# EAGLE design BR103_MKL_3357_21MTC_J1_006_01_06 (EAGLE 5.10)
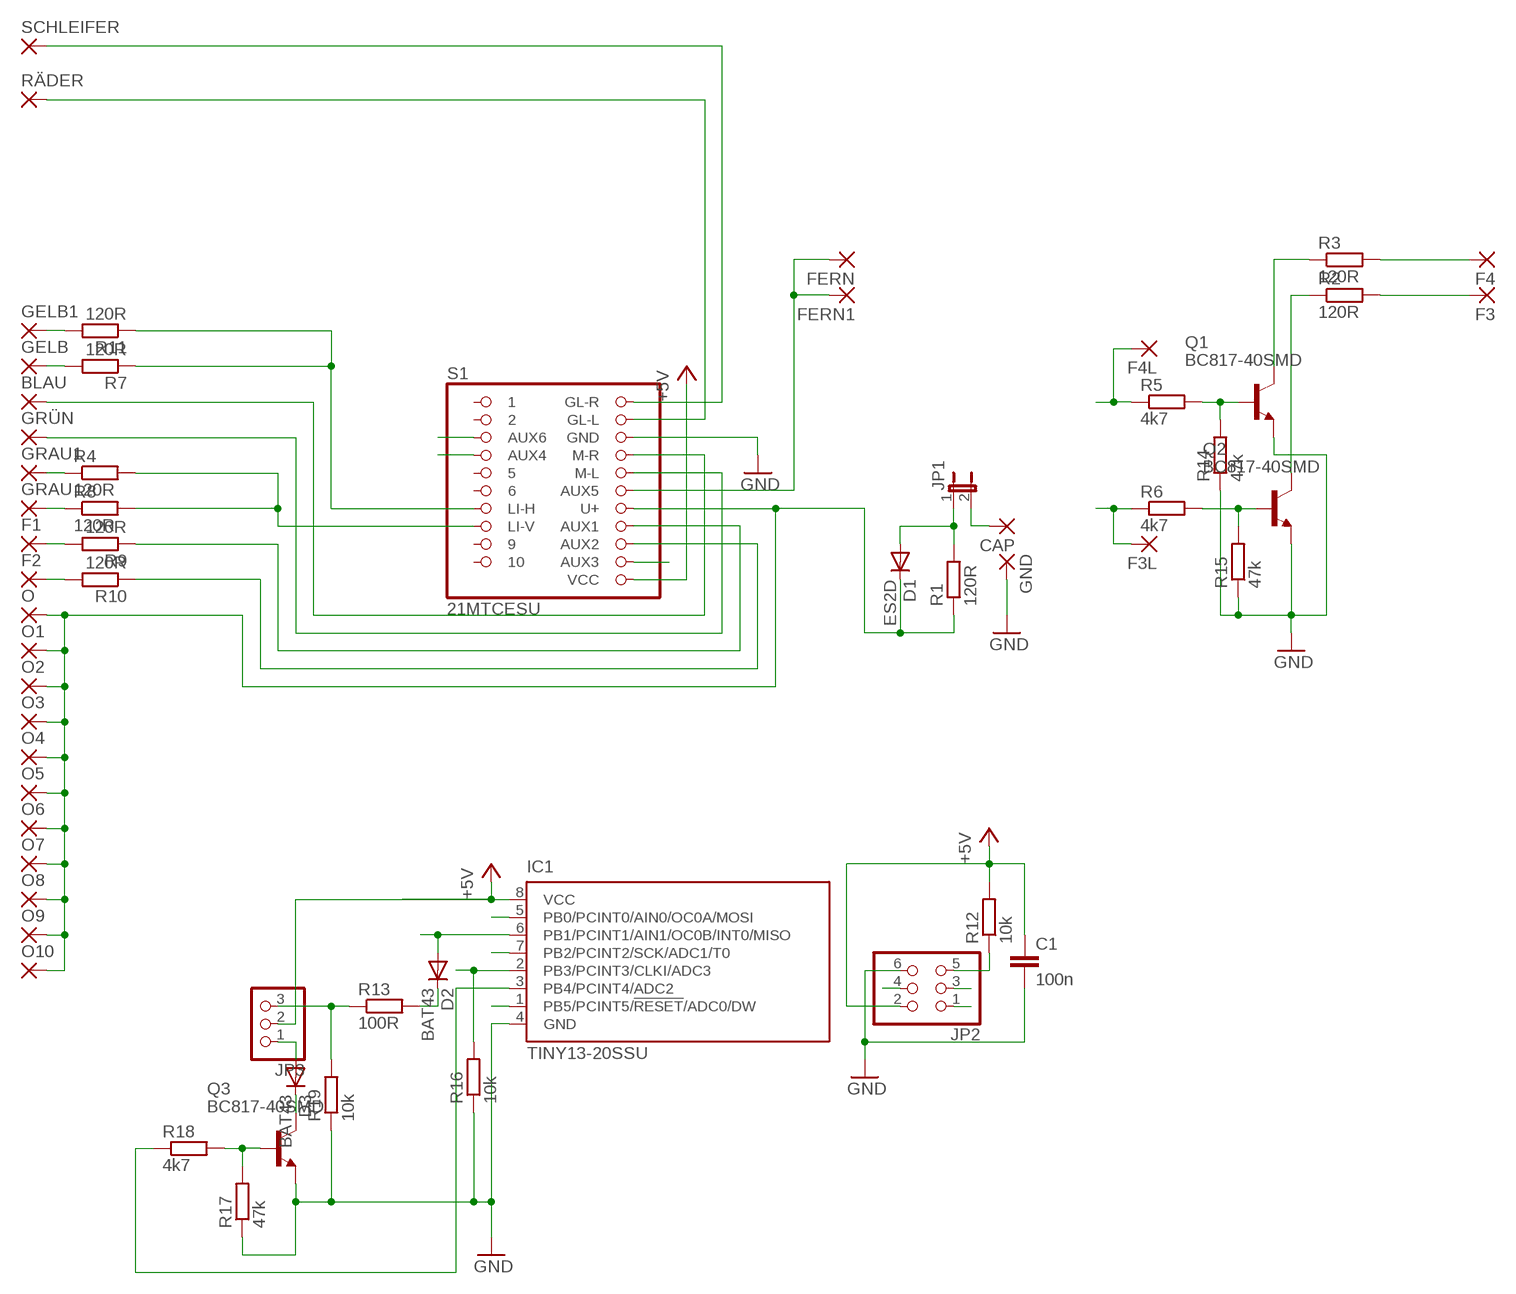
[diagram p0: schematic, sheet 1]

## Parts
BLAU  SMD2  [SMD1,27-2,54]
C1  100n  C-EUC0603  [C0603]
CAP  SMD2  [SMD1,27-2,54]
D1  ES2D  [SMB]
D2  BAT43  DIODE-SOD323-R2S  [SOD323-R2S]
D3  BAT43  DIODE-SOD323-R2S  [SOD323-R2S]
F1  SMD2  [SMD1,27-2,54]
F2  SMD2  [SMD1,27-2,54]
F3  SMD2  [SMD1,27-2,54]
F3L  SMD2  [SMD1,27-2,54]
F4  SMD2  [SMD1,27-2,54]
F4L  SMD2  [SMD1,27-2,54]
FERN  SMD2  [SMD1,27-2,54]
FERN1  SMD2  [SMD1,27-2,54]
GELB  SMD2  [SMD1,27-2,54]
GELB1  SMD2  [SMD1,27-2,54]
GND  SMD2  [SMD1,27-2,54]
GRAU  SMD2  [SMD1,27-2,54]
GRAU1  SMD2  [SMD1,27-2,54]
GRÜN  SMD2  [SMD1,27-2,54]
IC1  TINY13-20SSU  [8S1]
JP1  JP1E2,00  [JP1_2]
JP2  PINHD-2X3  [2X03]
JP3  PINHD-1X3ROUND  [1X03_R]
O  SMD2  [SMD1,27-2,54]
O1  SMD2  [SMD1,27-2,54]
O2  SMD2  [SMD1,27-2,54]
O3  SMD2  [SMD1,27-2,54]
O4  SMD2  [SMD1,27-2,54]
O5  SMD2  [SMD1,27-2,54]
O6  SMD2  [SMD1,27-2,54]
O7  SMD2  [SMD1,27-2,54]
O8  SMD2  [SMD1,27-2,54]
O9  SMD2  [SMD1,27-2,54]
O10  SMD2  [SMD1,27-2,54]
Q1  BC817-40SMD  [SOT23-BEC]
Q2  BC817-40SMD  [SOT23-BEC]
Q3  BC817-40SMD  [SOT23-BEC]
R1  120R  R-EU_R0603S  [R0603S]
R2  120R  R-EU_R0603S  [R0603S]
R3  120R  R-EU_R0603S  [R0603S]
R4  120R  R-EU_R0603S  [R0603S]
R5  4k7  R-EU_R0603  [R0603]
R6  4k7  R-EU_R0603  [R0603]
R7  120R  R-EU_R0603S  [R0603S]
R8  120R  R-EU_R0603S  [R0603S]
R9  120R  R-EU_R0603S  [R0603S]
R10  120R  R-EU_R0603S  [R0603S]
R11  120R  R-EU_R0603S  [R0603S]
R12  10k  R-EU_R0603  [R0603]
R13  100R  R-EU_R0603  [R0603]
R14  47k  R-EU_R0603  [R0603]
R15  47k  R-EU_R0603  [R0603]
R16  10k  R-EU_R0603  [R0603]
R17  47k  R-EU_R0603  [R0603]
R18  4k7  R-EU_R0603  [R0603]
R19  10k  R-EU_R0603  [R0603]
RÄDER  SMD2  [SMD1,27-2,54]
S1  21MTCESU  [21MTC_SMD_ESU]
SCHLEIFER  SMD2  [SMD1,27-2,54]

## Nets
+5V: C1.1 IC1.8(VCC) JP2.2 JP3.2 R12.2 S1.P12(VCC)
BLAU: BLAU.1(P) S1.P19(M-R)
CAP: D1.A JP1.1 R1.2
F1: R9.1 S1.P15(AUX1)
F2: R10.1 S1.P14(AUX2)
F3: F3L.1(P) R6.1 S1.P13(AUX3)
F4: F4L.1(P) R5.1 S1.P4(AUX4)
F6: IC1.2(PB3/PCINT3/CLKI/ADC3) R16.2 S1.P3(AUX6)
GELB: R7.1 R11.1 S1.P7(LI-H)
GND: C1.2 GND.1(P) IC1.4(GND) JP2.6 Q1.E Q2.E Q3.E R14.1 R15.1 R16.1 R17.1 R19.1 S1.P20(GND)
GRAU: R4.2 R8.2 S1.P8(LI-V)
GRÜN: GRÜN.1(P) S1.P18(M-L)
MISO: D2.A IC1.6(PB1/PCINT1/AIN1/OC0B/INT0/MISO) JP2.1
MOSI: IC1.5(PB0/PCINT0/AIN0/OC0A/MOSI) JP2.4
N$1: CAP.1(P) JP1.2
N$2: F3.1(P) R2.2
N$3: F1.1(P) R9.2
N$4: F4.1(P) R3.2
N$5: Q2.C R2.1
N$6: Q1.C R3.1
N$7: Q1.B R5.2 R14.2
N$8: Q2.B R6.2 R15.2
N$9: GELB.1(P) R7.2
N$10: GRAU.1(P) R8.1
N$11: F2.1(P) R10.2
N$12: GRAU1.1(P) R4.1
N$13: GELB1.1(P) R11.2
N$14: D3.C Q3.C
N$15: D3.A JP3.1
N$16: IC1.3(PB4/PCINT4/ADC2) R18.1
N$17: JP3.3 R13.1 R19.2
N$18: FERN1.1(P) FERN.1(P) S1.P17(AUX5)
N$21: D2.C R13.2
N$22: Q3.B R17.2 R18.2
ORANGE: D1.C O1.1(P) O2.1(P) O3.1(P) O4.1(P) O5.1(P) O6.1(P) O7.1(P) O8.1(P) O9.1(P) O10.1(P) O.1(P) R1.1 S1.P16(U+)
RES: IC1.1(PB5/PCINT5/!RESET!/ADC0/DW) JP2.5 R12.1
RÄDER: RÄDER.1(P) S1.P21(GL-L)
SCHLEIFER: S1.P22(GL-R) SCHLEIFER.1(P)
SCK: IC1.7(PB2/PCINT2/SCK/ADC1/T0) JP2.3
Unconnected: S1.P1 S1.P2 S1.P5 S1.P6 S1.P9 S1.P10

## Library data of the parts
BLAU CAP F1-F3 F3L F4 F4L FERN FERN1 GELB GELB1 GND GRAU GRAU1 GRÜN O O1-O10 RÄDER SCHLEIFER = wirepad:SMD2: SMD PAD
C1 = rcl:C-EU: CAPACITOR, European symbol
D1 = diode:ES2D: DIODE super fast rectifier, 2 A
D2 D3 = diode:DIODE-: DIODE
IC1 = atmel:TINY13: 8-bit AVR Microcontroller with 1K Bytes In-System Programmable Flash Source: http://www.atmel.com/dyn/resources/prod_documents/2535S.pdf
JP1 = jumper:JP1E: JUMPER
JP2 = pinhead:PINHD-2X3: PIN HEADER
JP3 = pinhead:PINHD-1X3: PIN HEADER
Q1-Q3 = transistor-npn:BC817*: NPN Transistor
R1-R19 = rcl:R-EU_: RESISTOR, European symbol
S1 = pinhead:21MTC

## Board
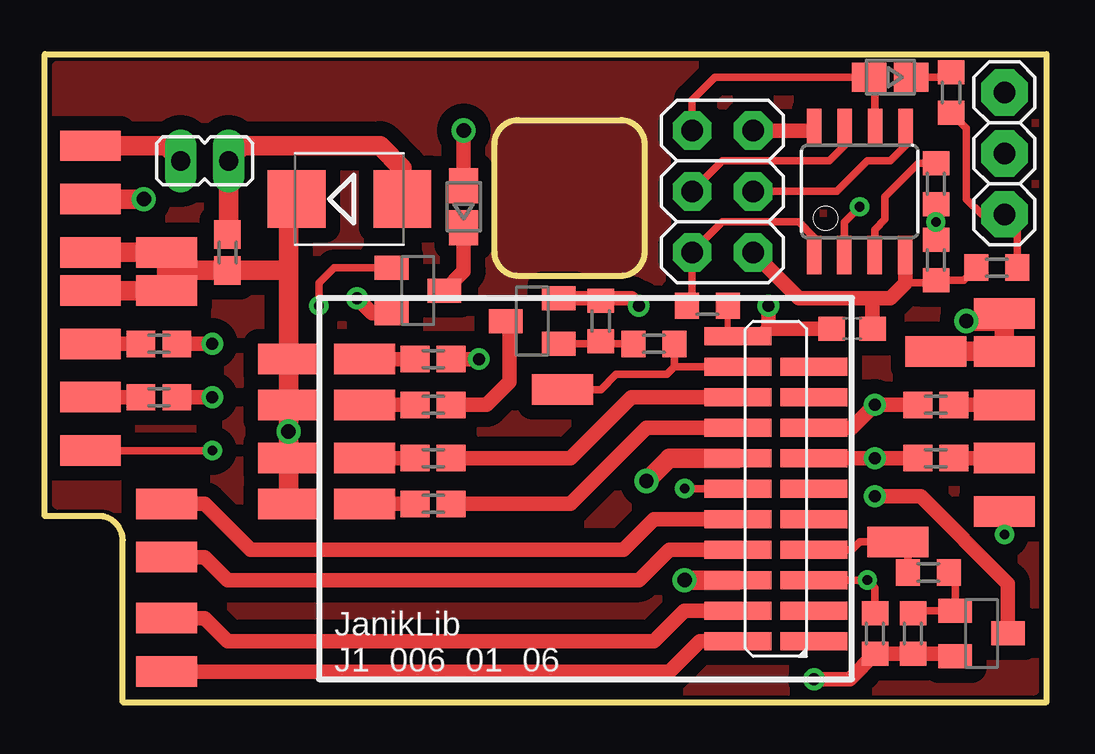
[diagram p1: board, top side]
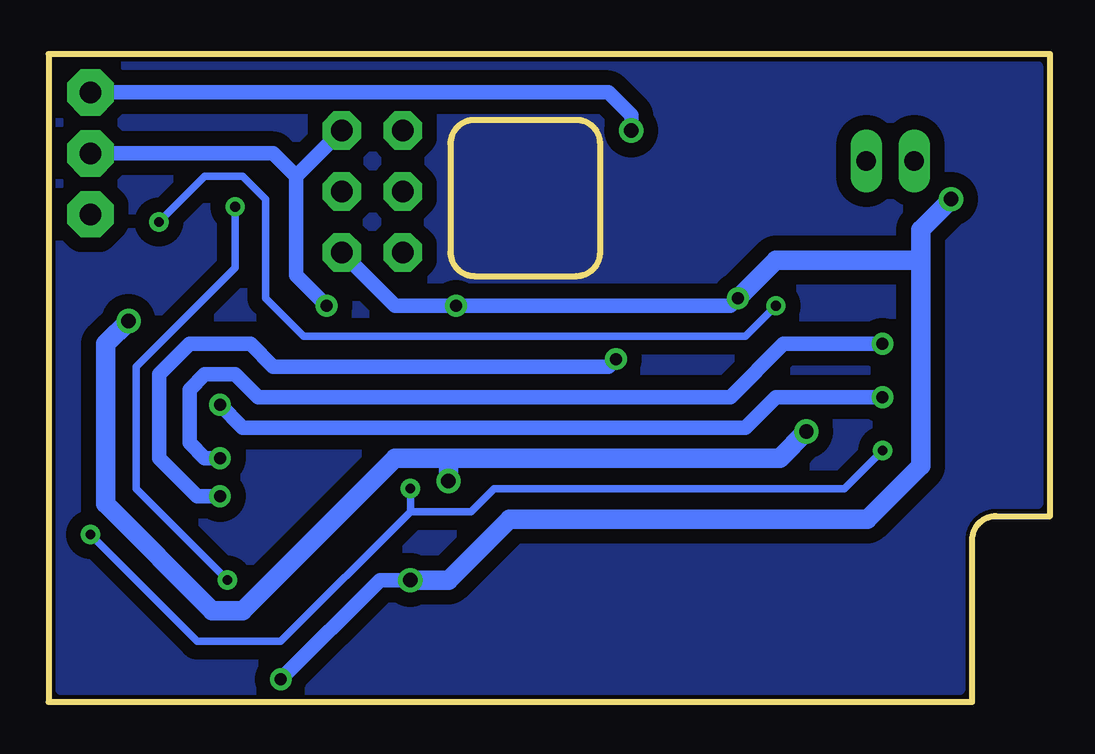
[diagram p2: board, bottom side, seen from below]

No outline drawn. Coordinates in mm, seen from the top.
Copper layers (1*16): Top 0.035mm / dielectric 1.5mm / Bottom 0.035mm
Design rules "default *": minimum track width 10mil, minimum drill 0.6mm, track to track 8mil, track to pad 8mil, pad to pad 8mil, via to via 8mil, smd to smd 8mil, copper to edge 40mil, drill to drill 8mil, minimum pad ring 10mil, minimum via ring 8mil, stop-mask expansion 4mil, vias tented up to drill 0mil, thermal gap 10mil
Milling: 15 lines

### Footprints (pad centres in the part's own frame; a part is rotated, then mirrored left to right if it is on the bottom)
SMD1,27-2,54 = smd 1.27 x 2.54: 1 0,0
C0603 = smd 1.1 x 1: 1 -0.85,0; 2 0.85,0
SMB = smd 2.4 x 2.4: A 2.2,0; C -2.2,0
SOD323-R2S = smd 1.45 x 1.2: A 0.875,0; C -0.875,0
8S1 = smd 0.6 x 1.6: 1 -1.905,-2.654; 2 -0.645,-2.654; 3 0.625,-2.654; 4 1.895,-2.654; 5 1.905,2.654; 6 0.635,2.654; 7 -0.635,2.654; 8 -1.905,2.654
JP1_2 = drill 0.8 long: 1 0,-1; 2 0,1
2X03 = drill 0.9 pad 1.6 octagon: 1 -2.54,-1.27; 2 -2.54,1.27; 3 0,-1.27; 4 0,1.27; 5 2.54,-1.27; 6 2.54,1.27
1X03_R = drill 0.9 pad 1.93 octagon: 1 -2.54,0; 2 0,0; 3 2.54,0
SOT23-BEC = smd 1 x 1.4: B -0.95,-1.1; C 0,1.1; E 0.95,-1.1
R0603S = smd 1.2 x 1.1: 1 -0.75,0; 2 0.75,0
R0603 = smd 1 x 1.1: 1 -0.85,0; 2 0.85,0
21MTC_SMD_ESU = smd 0.75 x 2.8: P1 -6.35,-0.953; P2 -5.08,-0.953; P3 -3.81,-0.953; P4 -2.54,-0.953; P5 -1.27,-0.953; P6 0,-0.953; P7 1.27,-0.953; P8 2.54,-0.953; P9 3.81,-0.953; P10 5.08,-0.953; P12 6.35,2.223; P13 5.08,2.223; P14 3.81,2.223; P15 2.54,2.223; P16 1.27,2.223; P17 0,2.223; P18 -1.27,2.223; P19 -2.54,2.223; P20 -3.81,2.223; P21 -5.08,2.223; P22 -6.35,2.223

### Placement (x,y rotation side)
BLAU  5.08,6.03 270 top
C1  33.66,15.56 0 top
CAP  1.91,23.18 270 top
D1  12.7,20.95 0 top
D2  35.24,26.04 180 top
D3  17.46,20.64 90 top
F1  13.34,8.26 270 top
F2  13.34,10.16 270 top
F3  13.34,12.38 270 top
F3L  21.59,13.02 270 top
F4  13.34,14.29 270 top
F4L  35.56,6.67 270 top
FERN  1.91,10.48 90 top
FERN1  40.01,7.94 90 top
GELB  1.91,14.92 270 top
GELB1  40.01,10.16 270 top
GND  1.91,20.95 270 top
GRAU  1.91,12.7 270 top
GRAU1  40.01,12.38 270 top
GRÜN  5.08,8.26 270 top
IC1  33.97,21.27 0 top
JP1  6.67,22.54 90 top
JP2  28.26,21.27 270 top
JP3  40.01,22.86 270 top
O  10.16,14.29 270 top
O1  1.91,18.73 270 top
O2  1.91,17.14 270 top
O3  5.08,18.73 270 top
O4  5.08,17.14 270 top
O5  10.16,12.38 270 top
O6  40.01,14.61 270 top
O7  10.16,10.16 90 top
O8  10.16,8.26 90 top
O9  37.15,14.61 90 top
O10  40.01,16.19 90 top
Q1  39.05,2.86 270 top
Q2  20.32,15.88 90 top
Q3  15.56,17.14 270 top
R1  7.62,18.73 90 top
R2  16.19,12.38 180 top
R3  16.19,14.29 180 top
R4  37.15,12.38 180 top
R5  36.83,5.4 0 top
R6  25.4,14.92 180 top
R7  4.76,14.92 180 top
R8  4.76,12.7 0 top
R9  16.19,8.26 180 top
R10  16.19,10.16 180 top
R11  37.15,10.16 0 top
R12  27.62,16.51 0 top
R13  37.78,25.4 90 top
R14  36.2,2.86 90 top
R15  23.18,15.88 270 top
R16  34.61,2.86 90 top
R17  37.15,18.41 90 top
R18  37.15,21.59 270 top
R19  39.69,18.1 0 top
RÄDER  5.08,3.49 90 top
S1  31.11,8.89 90 top
SCHLEIFER  5.08,1.27 270 top

### Tracks (layer width: path | path; a pad name or v marks a point on that pad's centre or on a via)
+5V  (via drill 0.5)
  Top 0.254: R12.2 28.47,15.24 S1.P12
  Top 0.61: IC1.8 31.95,23.81 JP2.2 | S1.P12 29.84,15.24 30.16,15.56 | 30.16,15.56 v30.16,16.51 | 30.16,15.56 C1.1
  Bottom 0.61: 31.43,21.91 JP2.2 | v30.16,16.51 31.43,17.78 31.43,21.91 | JP3.2 32.38,22.86 31.43,21.91
BLAU
  Top 0.61: S1.P19 26.04,6.35 24.77,5.08 7.62,5.08 6.67,6.03 BLAU.1
CAP
  Top 0.406: JP1.1 7.62,22.54
  Top 0.813: D1.A 14.9,22.25 13.97,23.18 8.26,23.18 7.67,22.59 JP1.1 7.67,19.48 R1.2
F1
  Top 0.61: S1.P15 25.08,11.43 21.91,8.26 R9.1
F2
  Top 0.61: S1.P14 24.45,12.7 21.91,10.16 R10.1
F3
  Top 0.305: 26.25,13.97 R6.1 | 26.25,13.97 S1.P13 | F3L.1 23.18,13.02 23.81,13.65 25.93,13.65 26.25,13.97
F4
  Top 0.305: S1.P4 33.66,6.35 33.97,6.67 F4L.1 35.98,6.25 R5.1
F6  (via drill 0.4)
  Top 0.305: IC1.2 33.33,19.99 v33.97,20.64 | S1.P3 v34.29,5.08 34.61,4.76 R16.2
  Bottom 0.305: v33.97,20.64 33.97,18.1 38.1,13.97 38.1,8.89 v34.29,5.08
GELB  (via drill 0.5)
  Top 0.61: R7.1 v6.99,14.92 | R11.1 v34.61,10.16 S1.P7
  Bottom 0.61: v34.61,10.16 35.24,10.16 35.88,10.79 35.88,13.02 35.24,13.65 33.97,13.65 33.02,12.7 13.34,12.7 11.11,14.92 v6.99,14.92
GND  (via drill 0.5, 0.6)
  Top 0.305: 35.87,17.46 37.05,17.46 R17.1 38.3,17.57 R19.1
  Top 0.61: 34.51,16.83 31.43,16.83 JP2.6 | 34.51,16.83 35.24,16.83 35.87,17.45 35.87,17.46 IC1.4 35.87,18.73 | 34.51,16.83 C1.2 | Q2.E 23.08,16.82 R15.1 23.28,16.83 24.45,16.83 v24.77,16.51 | v32.07,0.95 33.55,0.95 R16.1 R14.1 37.85,2.01 Q1.E | v13.02,16.83 13.65,16.2 Q3.E
  Top 0.813: v26.67,5.08 S1.P20 | v4.13,20.95 GND.1
  Bottom 0.61: v26.67,5.08 27.94,5.08 v32.07,0.95 | JP2.6 27.3,16.51 v24.77,16.51 13.34,16.51 v13.02,16.83
  Bottom 0.813: v26.67,5.08 25.08,5.08 22.54,7.62 7.62,7.62 5.4,9.84 5.4,18.41 | v4.13,20.95 5.4,19.68 5.4,18.41 | v13.02,16.83 11.43,18.41 5.4,18.41
GRAU  (via drill 0.5)
  Top 0.61: R8.2 v6.99,12.7 | R4.2 v34.61,12.38 33.66,11.43 S1.P8
  Bottom 0.61: v6.99,12.7 11.43,12.7 12.7,11.43 33.66,11.43 v34.61,12.38
GRÜN
  Top 0.61: S1.P18 25.4,7.62 24.13,6.35 8.57,6.35 6.67,8.26 GRÜN.1
MISO
  Top 0.305: JP2.1 26.99,25.08 27.94,26.04 D2.A 34.61,25.8 IC1.6
MOSI
  Top 0.305: IC1.5 35.88,23.18 35.24,22.54 34.29,22.54 33.02,21.27 JP2.4
N$1
  Top 0.813: CAP.1 5.03,23.18 JP1.2
N$2
  Top 0.61: F3.1 R2.2
N$3
  Top 0.61: F1.1 R9.2
N$4
  Top 0.61: F4.1 R3.2
N$5
  Top 0.61: R2.1 18.41,12.38 19.37,13.34 19.37,15.73 Q2.C
N$6  (via drill 0.5)
  Top 0.61: Q1.C 40.15,4.93 36.51,8.57 v34.61,8.57 | R3.1 v18.1,14.29
  Bottom 0.61: v34.61,8.57 35.56,8.57 37.15,10.16 37.15,13.65 35.88,14.92 33.34,14.92 32.38,13.97 18.41,13.97 v18.1,14.29
N$7
  Top 0.305: R14.2 36.3,3.81 Q1.B 37.95,5.12 R5.2
N$8
  Top 0.305: Q2.B 23.08,14.93 R15.2 23.28,14.92 R6.2
N$9
  Top 0.61: GELB.1 R7.2
N$10
  Top 0.61: GRAU.1 R8.1
N$11
  Top 0.61: F2.1 R10.2
N$12
  Top 0.61: R4.1 GRAU1.1
N$13
  Top 0.61: R11.2 GELB1.1
N$14
  Top 0.61: Q3.C 17.46,17.95 D3.C
N$15  (via drill 0.6)
  Top 0.61: D3.A v17.46,23.81
  Bottom 0.61: JP3.1 18.41,25.4 17.46,24.45 v17.46,23.81
N$16
  Top 0.254: IC1.3
  Top 0.305: IC1.3 34.61,19.68 35.03,20.11 35.03,21.06 36.41,22.44 R18.1
N$17
  Top 0.305: R13.1 38.42,23.91 38.42,20.95 39.05,20.32 JP3.3 40.54,19.79 R19.2
N$18  (via drill 0.4)
  Top 0.305: v26.67,8.89 S1.P17 | FERN.1 v6.99,10.48 | v40.01,6.99 FERN1.1
  Bottom 0.305: v40.01,6.99 35.56,2.54 32.07,2.54 26.67,7.94 | v6.99,10.48 8.57,8.89 23.18,8.89 24.13,7.94 26.67,7.94 | 26.67,7.94 v26.67,8.89
N$19
  pour Bottom (isolate 0.61): 41.25,26.5 0.5,26.5 0.5,8.25 2.25,8.25 arc-90 3.75,6.75 3.75,0.5 41.25,0.5
N$20
  pour Top (isolate 0.61): 41.25,26.5 0.5,26.5 0.5,8.25 2.25,8.25 arc-90 3.75,6.75 3.75,0.5 41.25,0.5
N$21
  Top 0.305: D2.C 37.57,26.04 R13.2
N$22  (via drill 0.4)
  Top 0.305: R17.2 v37.15,20 R18.2 | v11.43,16.51 11.43,17.46 12.06,18.09 Q3.B
  Bottom 0.305: v37.15,20 35.24,21.91 33.66,21.91 32.7,20.95 32.7,16.83 31.11,15.24 12.7,15.24 v11.43,16.51
ORANGE  (via drill 0.6)
  Top 0.813: S1.P16 26.04,10.16 v25.08,9.21 | O2.1 O4.1 5.08,17.98 | O1.1 O3.1 5.08,17.98 | O9.1 O6.1 O10.1 39.69,15.88 v38.42,15.88 | O8.1 O7.1 O5.1 | O5.1 v10.16,11.27 | O5.1 O.1 10.16,17.98 | D1.C 10.5,20.36 10.16,20.02 10.16,17.98 | 10.16,17.98 R1.1 5.08,17.98
  Bottom 0.813: 25.08,10.16 27.3,10.16 33.66,3.81 34.92,3.81 39.37,8.26 39.37,14.92 v38.42,15.88 | v10.16,11.27 11.27,10.16 25.08,10.16 | 25.08,10.16 v25.08,9.21
RES
  Top 0.305: IC1.1 32.07,19.37 31.43,20 28.26,20 JP2.5 26.99,16.73 R12.1
RÄDER
  Top 0.61: RÄDER.1 6.67,3.49 7.62,2.54 25.4,2.54 26.67,3.81 S1.P21
SCHLEIFER
  Top 0.61: SCHLEIFER.1 26.04,1.27 27.3,2.54 S1.P22
SCK
  Top 0.305: JP2.3 28.26,22.54 32.7,22.54 33.34,23.18 IC1.7

### Text on the board
tNames: JanikLib | J1_006_01_06
tStop: BR103/111 21MTC Servo | 1
bStop: design by Janik Merz | Servo Steuerung | Für Märklin 3357/3042 | BR103/111 21MTC
Document: C-Jump | C+ | C- | Plus | rot v | Plus | AUX4 | wei v | AUX3 | F3 | rot h | Fernl | F5 | AUX2 | wei h | Plus | AUX1 | Grün | F5 | Fernl | F4 | Blau | Räder | Schleif | F6